# EAGLE design energia (EAGLE 6.1)

## Sheet 1 of 4: Base
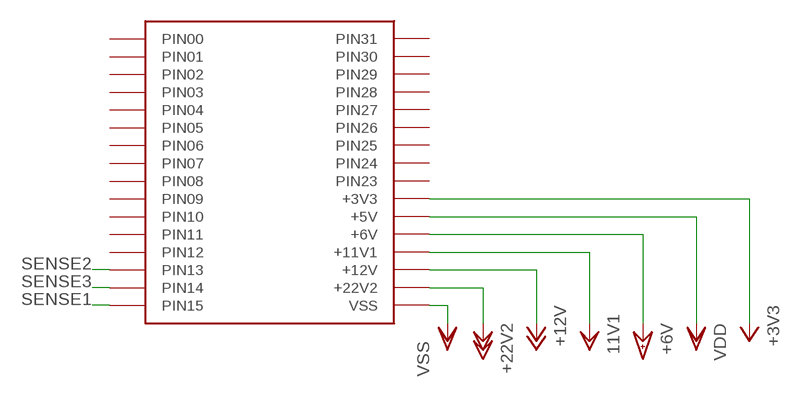
[diagram p0: schematic, sheet 1]

### Parts
U$1  BASE  [BASE]

### Nets
+3V3: U$1.PIN22(+3V3) ; also sheet 3
+6V: U$1.PIN20(+6V) ; also sheet 2
+11V1: U$1.PIN19(+11V1) ; supply symbol labelled 11V1 ; also sheet 3
+12V: U$1.PIN18(+12V) ; also sheet 2
+22V: U$1.PIN17(+22V2) ; supply symbol labelled +22V2 ; also sheet 2
SENSE1: U$1.PIN15 ; also sheet 4
SENSE2: U$1.PIN13 ; also sheet 4
SENSE3: U$1.PIN14 ; also sheet 4
VDD: U$1.PIN21(+5V) ; also sheet 3,4
VSS: U$1.PIN16(VSS) ; also sheet 2,3,4
Unconnected: U$1.PIN00 U$1.PIN01 U$1.PIN02 U$1.PIN03 U$1.PIN04 U$1.PIN05 U$1.PIN06 U$1.PIN07 U$1.PIN08 U$1.PIN09 U$1.PIN10 U$1.PIN11 U$1.PIN12 U$1.PIN23 U$1.PIN24 U$1.PIN25 U$1.PIN26 U$1.PIN27 U$1.PIN28 U$1.PIN29 U$1.PIN30 U$1.PIN31

## Sheet 2 of 4: Actuadores
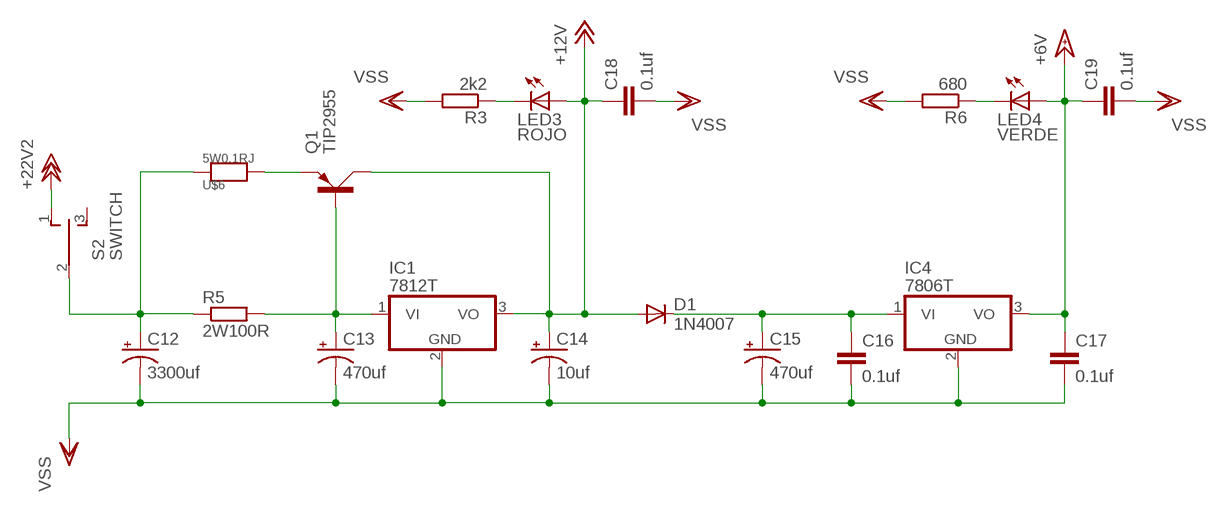
[diagram p1: schematic, sheet 2]

### Parts
C12  3300uf  CPOL-USE7.5-18  [E7,5-18]
C13  470uf  CPOL-USE3.5-8  [E3,5-8]
C14  10uf  CPOL-USE2.5-5  [E2,5-5]
C15  470uf  CPOL-USE3.5-8  [E3,5-8]
C16  0.1uf  C-EU050-024X044  [C050-024X044]
C17  0.1uf  C-EU050-024X044  [C050-024X044]
C18  0.1uf  C-EU050-024X044  [C050-024X044]
C19  0.1uf  C-EU050-024X044  [C050-024X044]
D1  1N4007  1N4004  [DO41-10]
IC1  7812T  [TO220H]
IC4  7806T  [TO220H]
LED3  ROJO  LED3MM  [LED3MM]
LED4  VERDE  LED3MM  [LED3MM]
Q1  TIP2955  [TOP3AV]
R3  2k2  R-EU_0204/5  [0204/5]
R5  2W100R  R-EU_0411/12  [0411/12]
R6  680  R-EU_0204/5  [0204/5]
S2  SWITCH  TL39YOSWITCH_2_ESTADOS  [TL3XYO]
U$6  5W0.1RJ  RESISTENCIA5WATT  [RES-22X10]

### Nets
+6V: C17.1 C19.1 IC4.3(VO) LED4.A ; also sheet 1
+12V: C14.+ C18.1 D1.A IC1.3(VO) LED3.A Q1.C ; also sheet 1
+22V: S2.1(O) ; supply symbol labelled +22V2 ; also sheet 1
N$3: LED3.K(C) R3.1
N$4: C12.+ R5.1 S2.2(P) U$6.P$1
N$7: Q1.E U$6.P$2
N$8: C13.+ IC1.1(VI) Q1.B R5.2
N$9: LED4.K(C) R6.1
N$13: C15.+ C16.1 D1.C IC4.1(VI)
VSS: C12.- C13.- C14.- C15.- C16.2 C17.2 C18.2 C19.2 IC1.2(GND) IC4.2(GND) R3.2 R6.2 ; also sheet 1,3,4
Unconnected: S2.3(S)

## Sheet 3 of 4: Energia Nucleo
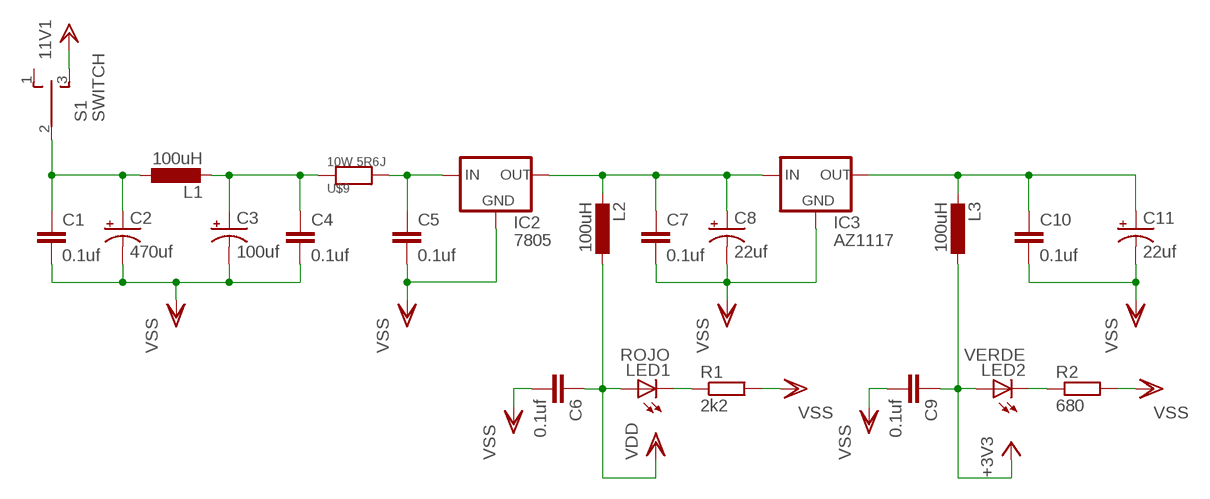
[diagram p2: schematic, sheet 3]

### Parts
C1  0.1uf  C-EU050-024X044  [C050-024X044]
C2  470uf  CPOL-USE2.5-7  [E2,5-7]
C3  100uf  CPOL-USE2.5-7  [E2,5-7]
C4  0.1uf  C-EU050-024X044  [C050-024X044]
C5  0.1uf  C-EU050-024X044  [C050-024X044]
C6  0.1uf  C-EU050-024X044  [C050-024X044]
C7  0.1uf  C-EU050-024X044  [C050-024X044]
C8  22uf  CPOL-USE2.5-7  [E2,5-7]
C9  0.1uf  C-EU050-024X044  [C050-024X044]
C10  0.1uf  C-EU050-024X044  [C050-024X044]
C11  22uf  CPOL-USE2.5-7  [E2,5-7]
IC2  7805  V_REG_78XX-TO-220  [TO-220-ALT]
IC3  AZ1117  V_REG_LD1117VXX  [78XXL]
L1  100uH  L-EUTFI0307  [TFI0307]
L2  100uH  L-EU0207/7  [0207/7]
L3  100uH  L-EU0207/7  [0207/7]
LED1  ROJO  LED3MM  [LED3MM]
LED2  VERDE  LED3MM  [LED3MM]
R1  2k2  R-EU_0204/5  [0204/5]
R2  680  R-EU_0204/5  [0204/5]
S1  SWITCH  TL39YOSWITCH_2_ESTADOS  [TL3XYO]
U$9  10W 5R6J  RESISTENCIA10W  [RES-49X10]

### Nets
+3V3: C9.1 L3.1 LED2.A ; also sheet 1
+11V1: S1.3(S) ; supply symbol labelled 11V1 ; also sheet 1
N$1: C1.1 C2.+ L1.1 S1.2(P)
N$10: C5.1 IC2.IN U$9.P$2
N$11: C3.+ C4.1 L1.2 U$9.P$1
N$12: C7.1 C8.+ IC2.OUT IC3.OUT(IN) L2.2
N$14: LED1.K(C) R1.1
N$17: C10.1 C11.+ IC3.GND(OUT) L3.2
N$18: LED2.K(C) R2.1
VDD: C6.1 L2.1 LED1.A ; also sheet 1,4
VSS: C1.2 C2.- C3.- C4.2 C5.2 C6.2 C7.2 C8.- C9.2 C10.2 C11.- IC2.GND IC3.IN(GND) R1.2 R2.2 ; also sheet 1,2,4
Unconnected: S1.1(O)

## Sheet 4 of 4: Monitor Lipo
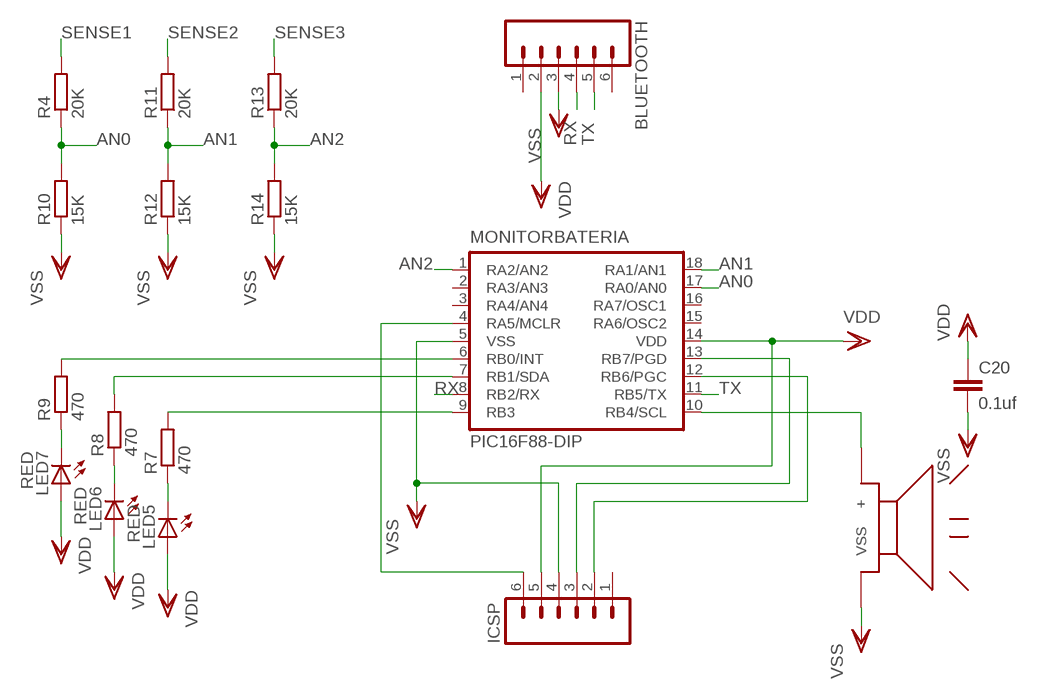
[diagram p3: schematic, sheet 4]

### Parts
BLUETOOTH  M06LONGPADS  [1X06_LONGPADS]
C20  0.1uf  C-EU050-024X044  [C050-024X044]
ICSP  M06LONGPADS  [1X06_LONGPADS]
LED5  RED  LED3MM  [LED3MM]
LED6  RED  LED3MM  [LED3MM]
LED7  RED  LED3MM  [LED3MM]
MONITORBATERIA  PIC16F88-DIP  [DIL18]
R4  20K  R-EU_0204/5  [0204/5]
R7  470  R-EU_0204/5  [0204/5]
R8  470  R-EU_0204/5  [0204/5]
R9  470  R-EU_0204/5  [0204/5]
R10  15K  R-EU_0204/5  [0204/5]
R11  20K  R-EU_0204/5  [0204/5]
R12  15K  R-EU_0204/5  [0204/5]
R13  20K  R-EU_0204/5  [0204/5]
R14  15K  R-EU_0204/5  [0204/5]
U$10  BUZZER  [BUZZER]

### Nets
AN0: MONITORBATERIA.17(RA0/AN0) R4.1 R10.2
AN1: MONITORBATERIA.18(RA1/AN1) R11.1 R12.2
AN2: MONITORBATERIA.1(RA2/AN2) R13.1 R14.2
N$2: ICSP.6 MONITORBATERIA.4(RA5/MCLR)
N$5: ICSP.3 MONITORBATERIA.13(RB7/PGD)
N$6: ICSP.2 MONITORBATERIA.12(RB6/PGC)
N$15: LED5.K(C) R7.1
N$16: LED7.K(C) R9.1
N$19: LED6.K(C) R8.1
N$20: MONITORBATERIA.6(RB0/INT) R9.2
N$21: MONITORBATERIA.7(RB1/SDA) R8.2
N$22: MONITORBATERIA.9(RB3) R7.2
N$24: MONITORBATERIA.10(RB4/SCL) U$10.+
RX: BLUETOOTH.4 MONITORBATERIA.8(RB2/RX)
SENSE1: R4.2 ; also sheet 1
SENSE2: R11.2 ; also sheet 1
SENSE3: R13.2 ; also sheet 1
TX: BLUETOOTH.5 MONITORBATERIA.11(RB5/TX)
VDD: BLUETOOTH.2 C20.1 ICSP.5 LED5.A LED6.A LED7.A MONITORBATERIA.14(VDD) ; also sheet 1,3
VSS: BLUETOOTH.3 C20.2 ICSP.4 MONITORBATERIA.5(VSS) R10.1 R12.1 R14.1 U$10.-(VSS) ; also sheet 1,2,3
Unconnected: BLUETOOTH.1 BLUETOOTH.6 ICSP.1 MONITORBATERIA.2(RA3/AN3) MONITORBATERIA.3(RA4/AN4) MONITORBATERIA.15(RA6/OSC2) MONITORBATERIA.16(RA7/OSC1)

## Library data of the parts
BLUETOOTH ICSP = SparkFun:M06: Header 6 Standard 6-pin 0.1" header. Use with straight break away headers (SKU : PRT-00116), right angle break away headers (PRT-00553), swiss pins (PRT-00743), machine pins (PRT-00117), and female headers (PRT-00115). Molex polarized connector foot print use with SKU : PRT-08094 with associated crimp pins and housings. NOTES ON THE VARIANTS LOCK and LOCK_LONGPADS... This footprint was designed to help hold the alignment of a through-hole component (i.e. 6-pin header) while soldering it into place. You may notice that each hole has been shifted either up or down by 0.005 of an inch from it's more standard position (which is a perfectly straight line). This slight alteration caused the pins (the squares in the middle) to touch the edges of the holes. Because they are alternating, it causes a "brace" to hold the component in place. 0.005 has proven to be the perfect amount of "off-center" position when using our standard breakaway headers. Although looks a little odd when you look at the bare footprint, once you have a header in there, the alteration is very hard to notice. Also, if you push a header all the way into place, it is covered up entirely on the bottom side. This idea of altering the position of holes to aid alignment will be further integrated into the Sparkfun Library for other footprints. It can help hold any component with 3 or more connection pins.
C1 C4-C7 C9 C10 C16-C20 = rcl:C-EU: CAPACITOR, European symbol
C2 C3 C8 C11-C15 = rcl:CPOL-US: POLARIZED CAPACITOR, American symbol
D1 = diode:1N4004: DIODE general purpose rectifier, 1 A
IC1 IC4 = adafruit:78*: Positive VOLTAGE REGULATOR Added bigger pads to the TO-92 package
IC2 = SparkFun:V_REG_78XX: Voltage Regulator Standard 7805 5V regulator. IGO (Input Ground Output). Spark Fun Electronics SKU : COM-00107
IC3 = SparkFun:V_REG_LD1117VXX: LD1117VXX voltage regulator. We carry the 3.3V version (COM-00526) in TO-220 package.
L1-L3 = rcl:L-EU: INDUCTOR, European symbol
LED1-LED7 = adafruit:LED: LED OSRAM: - CHIPLED LG R971, LG N971, LY N971, LG Q971, LY Q971, LO R971, LY R971 LH N974, LH R974 LS Q976, LO Q976, LY Q976 LO Q996 - Hyper CHIPLED LW Q18S LB Q993, LB Q99A, LB R99A - SideLED LS A670, LO A670, LY A670, LG A670, LP A670 LB A673, LV A673, LT A673, LW A673 LH A674 LY A675 LS A676, LA A676, LO A676, LY A676, LW A676 LS A679, LY A679, LG A679 - Hyper Micro SIDELED® LS Y876, LA Y876, LO Y876, LY Y876 LT Y87S - SmartLED LW L88C, LW L88S LB L89C, LB L89S, LG L890 LS L89K, LO L89K, LY L89K LS L896, LA L896, LO L896, LY L896 - TOPLED LS T670, LO T670, LY T670, LG T670, LP T670 LSG T670, LSP T670, LSY T670, LOP T670, LYG T670 LG T671, LOG T671, LSG T671 LB T673, LV T673, LT T673, LW T673 LH T674 LS T676, LA T676, LO T676, LY T676, LB T676, LH T676, LSB T676, LW T676 LB T67C, LV T67C, LT T67C, LS T67K, LO T67K, LY T67K, LW E67C LS E67B, LA E67B, LO E67B, LY E67B, LB E67C, LV E67C, LT E67C LW T67C LS T679, LY T679, LG T679 LS T770, LO T770, LY T770, LG T770, LP T770 LB T773, LV T773, LT T773, LW T773 LH T774 LS E675, LA E675, LY E675, LS T675 LS T776, LA T776, LO T776, LY T776, LB T776 LHGB T686 LT T68C, LB T68C - Hyper Mini TOPLED® LB M676 - Mini TOPLED Santana® LG M470 LS M47K, LO M47K, LY M47K Source: http://www.osram.convergy.de/
MONITORBATERIA = SparkFun:PIC16F88-DIP
Q1 = transistor-power:TIP2955: PNP TRANSISTOR
R1-R14 = rcl:R-EU_: RESISTOR, European symbol
S1 S2 = aasanchez:TL39YO: TINY SWITCH ON OFF ON Source: http://www2.produktinfo.conrad.com/datenblaetter/700000-724999/705152-da-01-de-Subminiaturschalter_TL_36YO.pdf
U$1 = aasanchez:BASE
U$6 U$9 = aasanchez:RESISTENCIA
U$10 = aasanchez:BUZZER

## Board
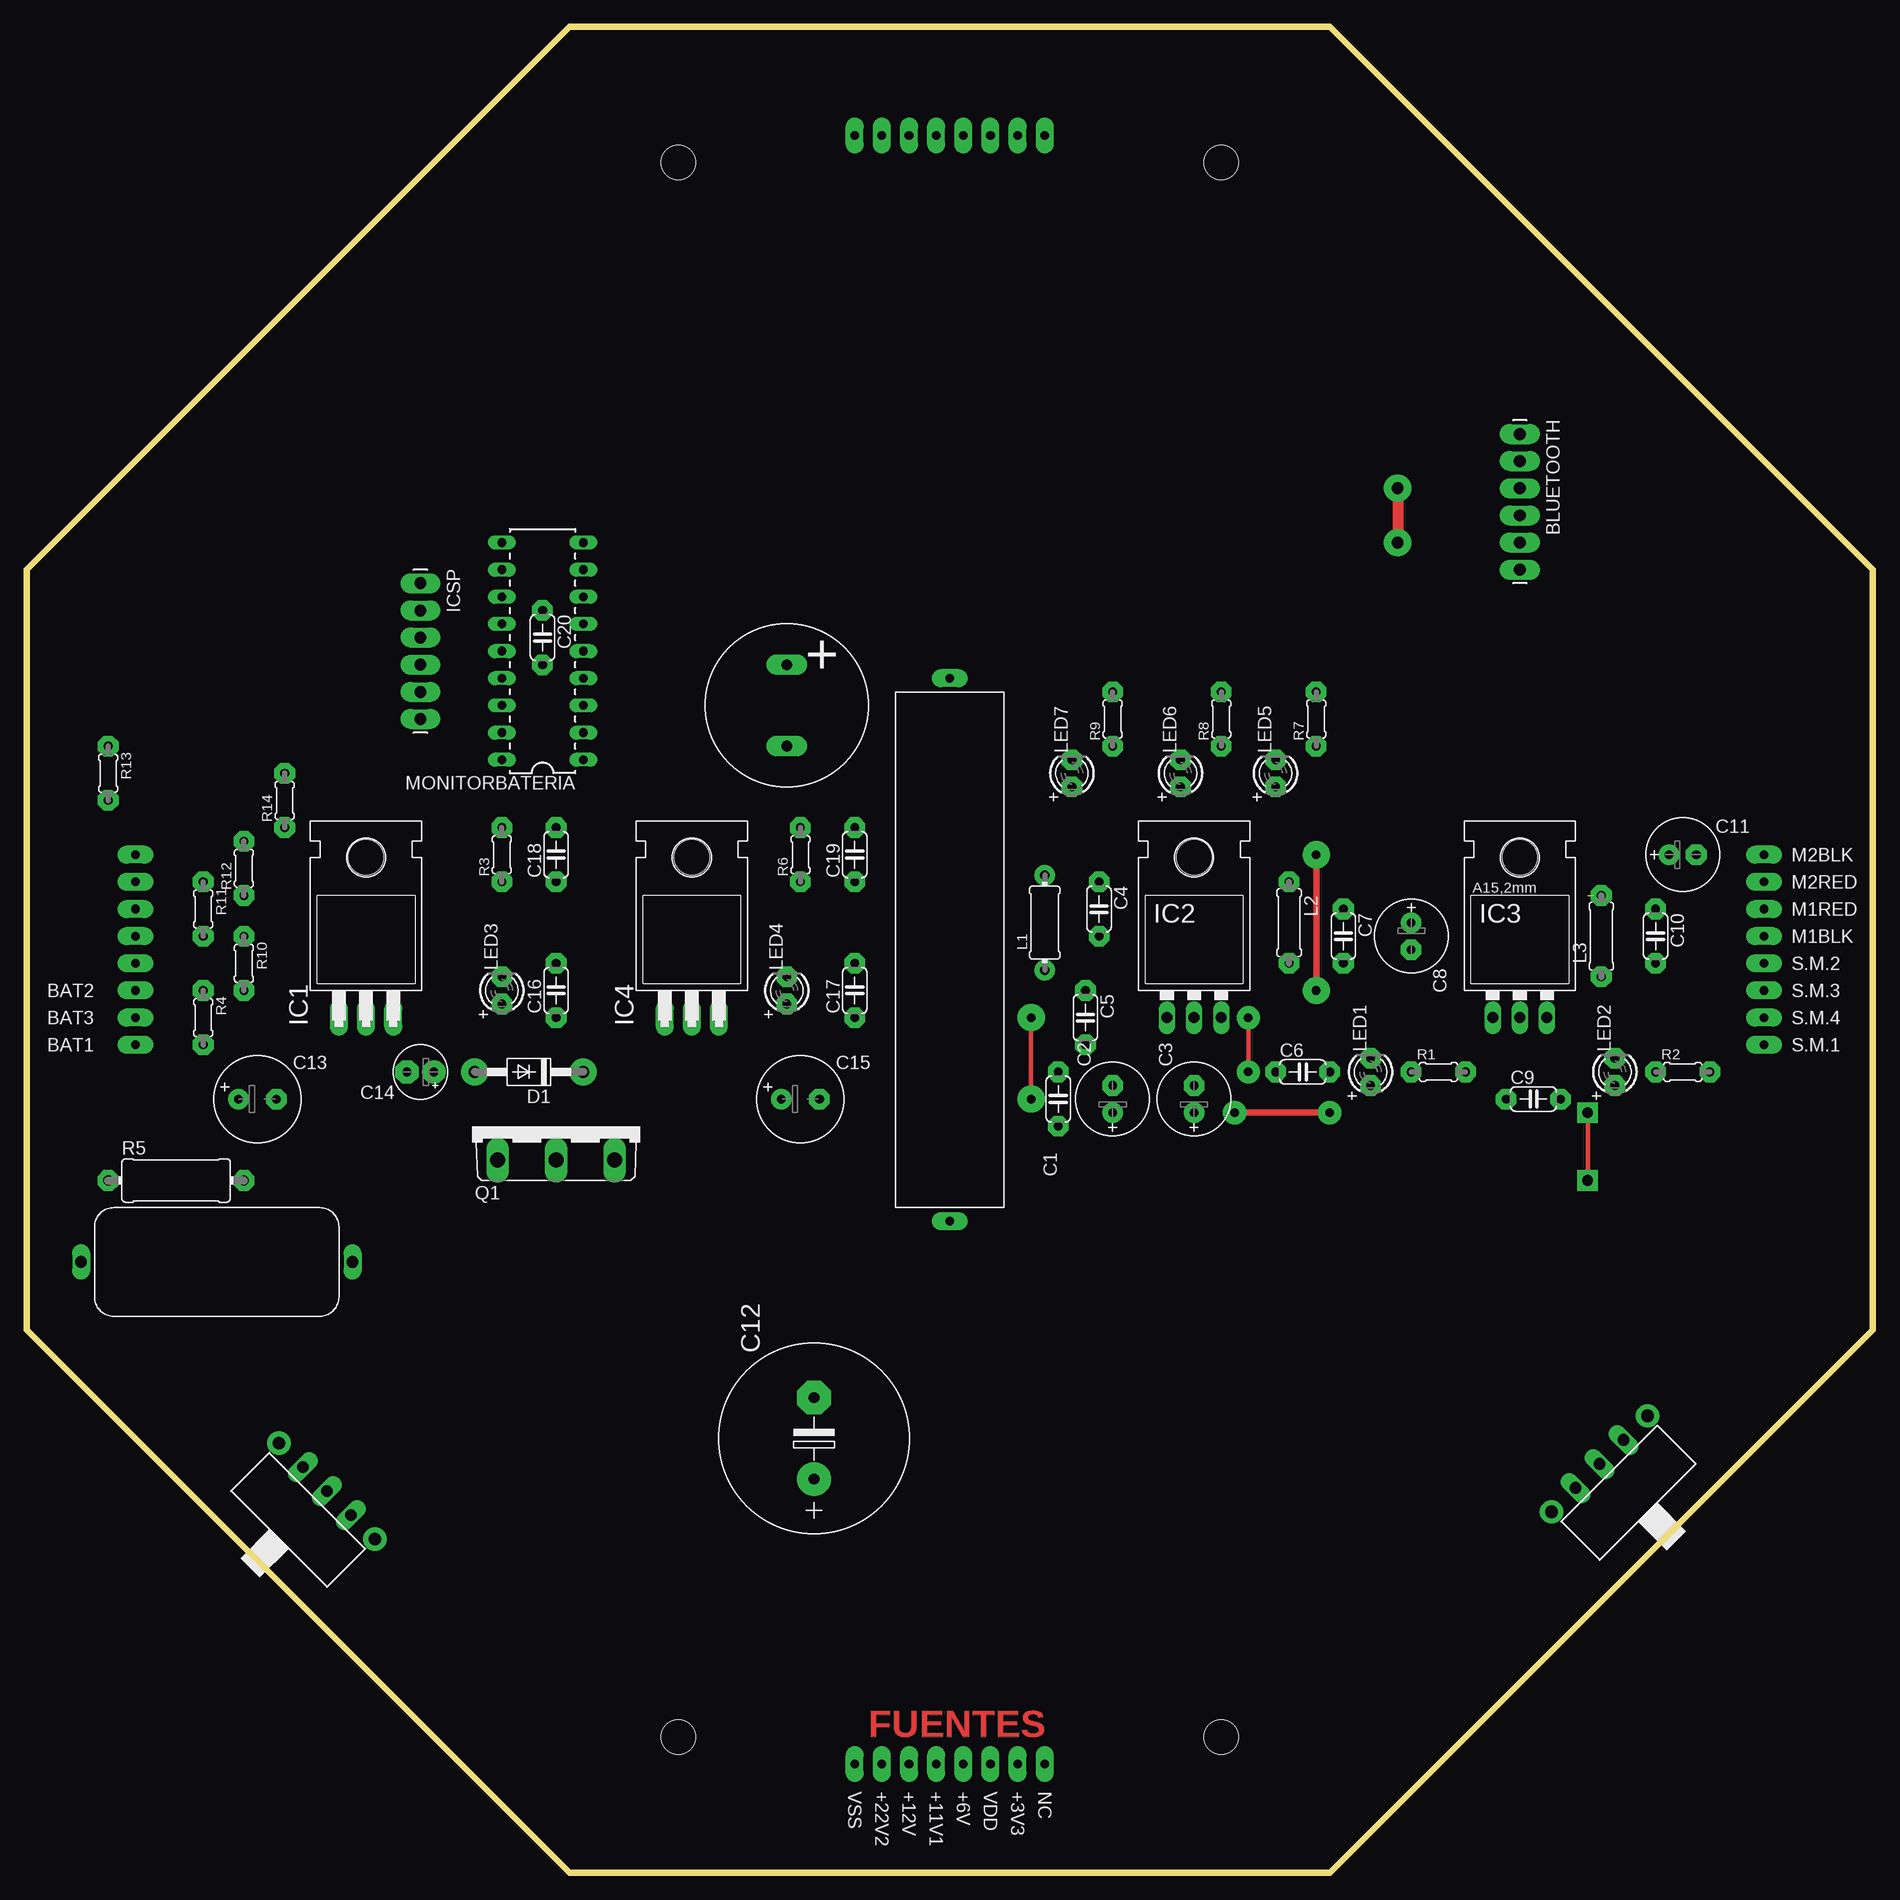
[diagram p4: board, top side]
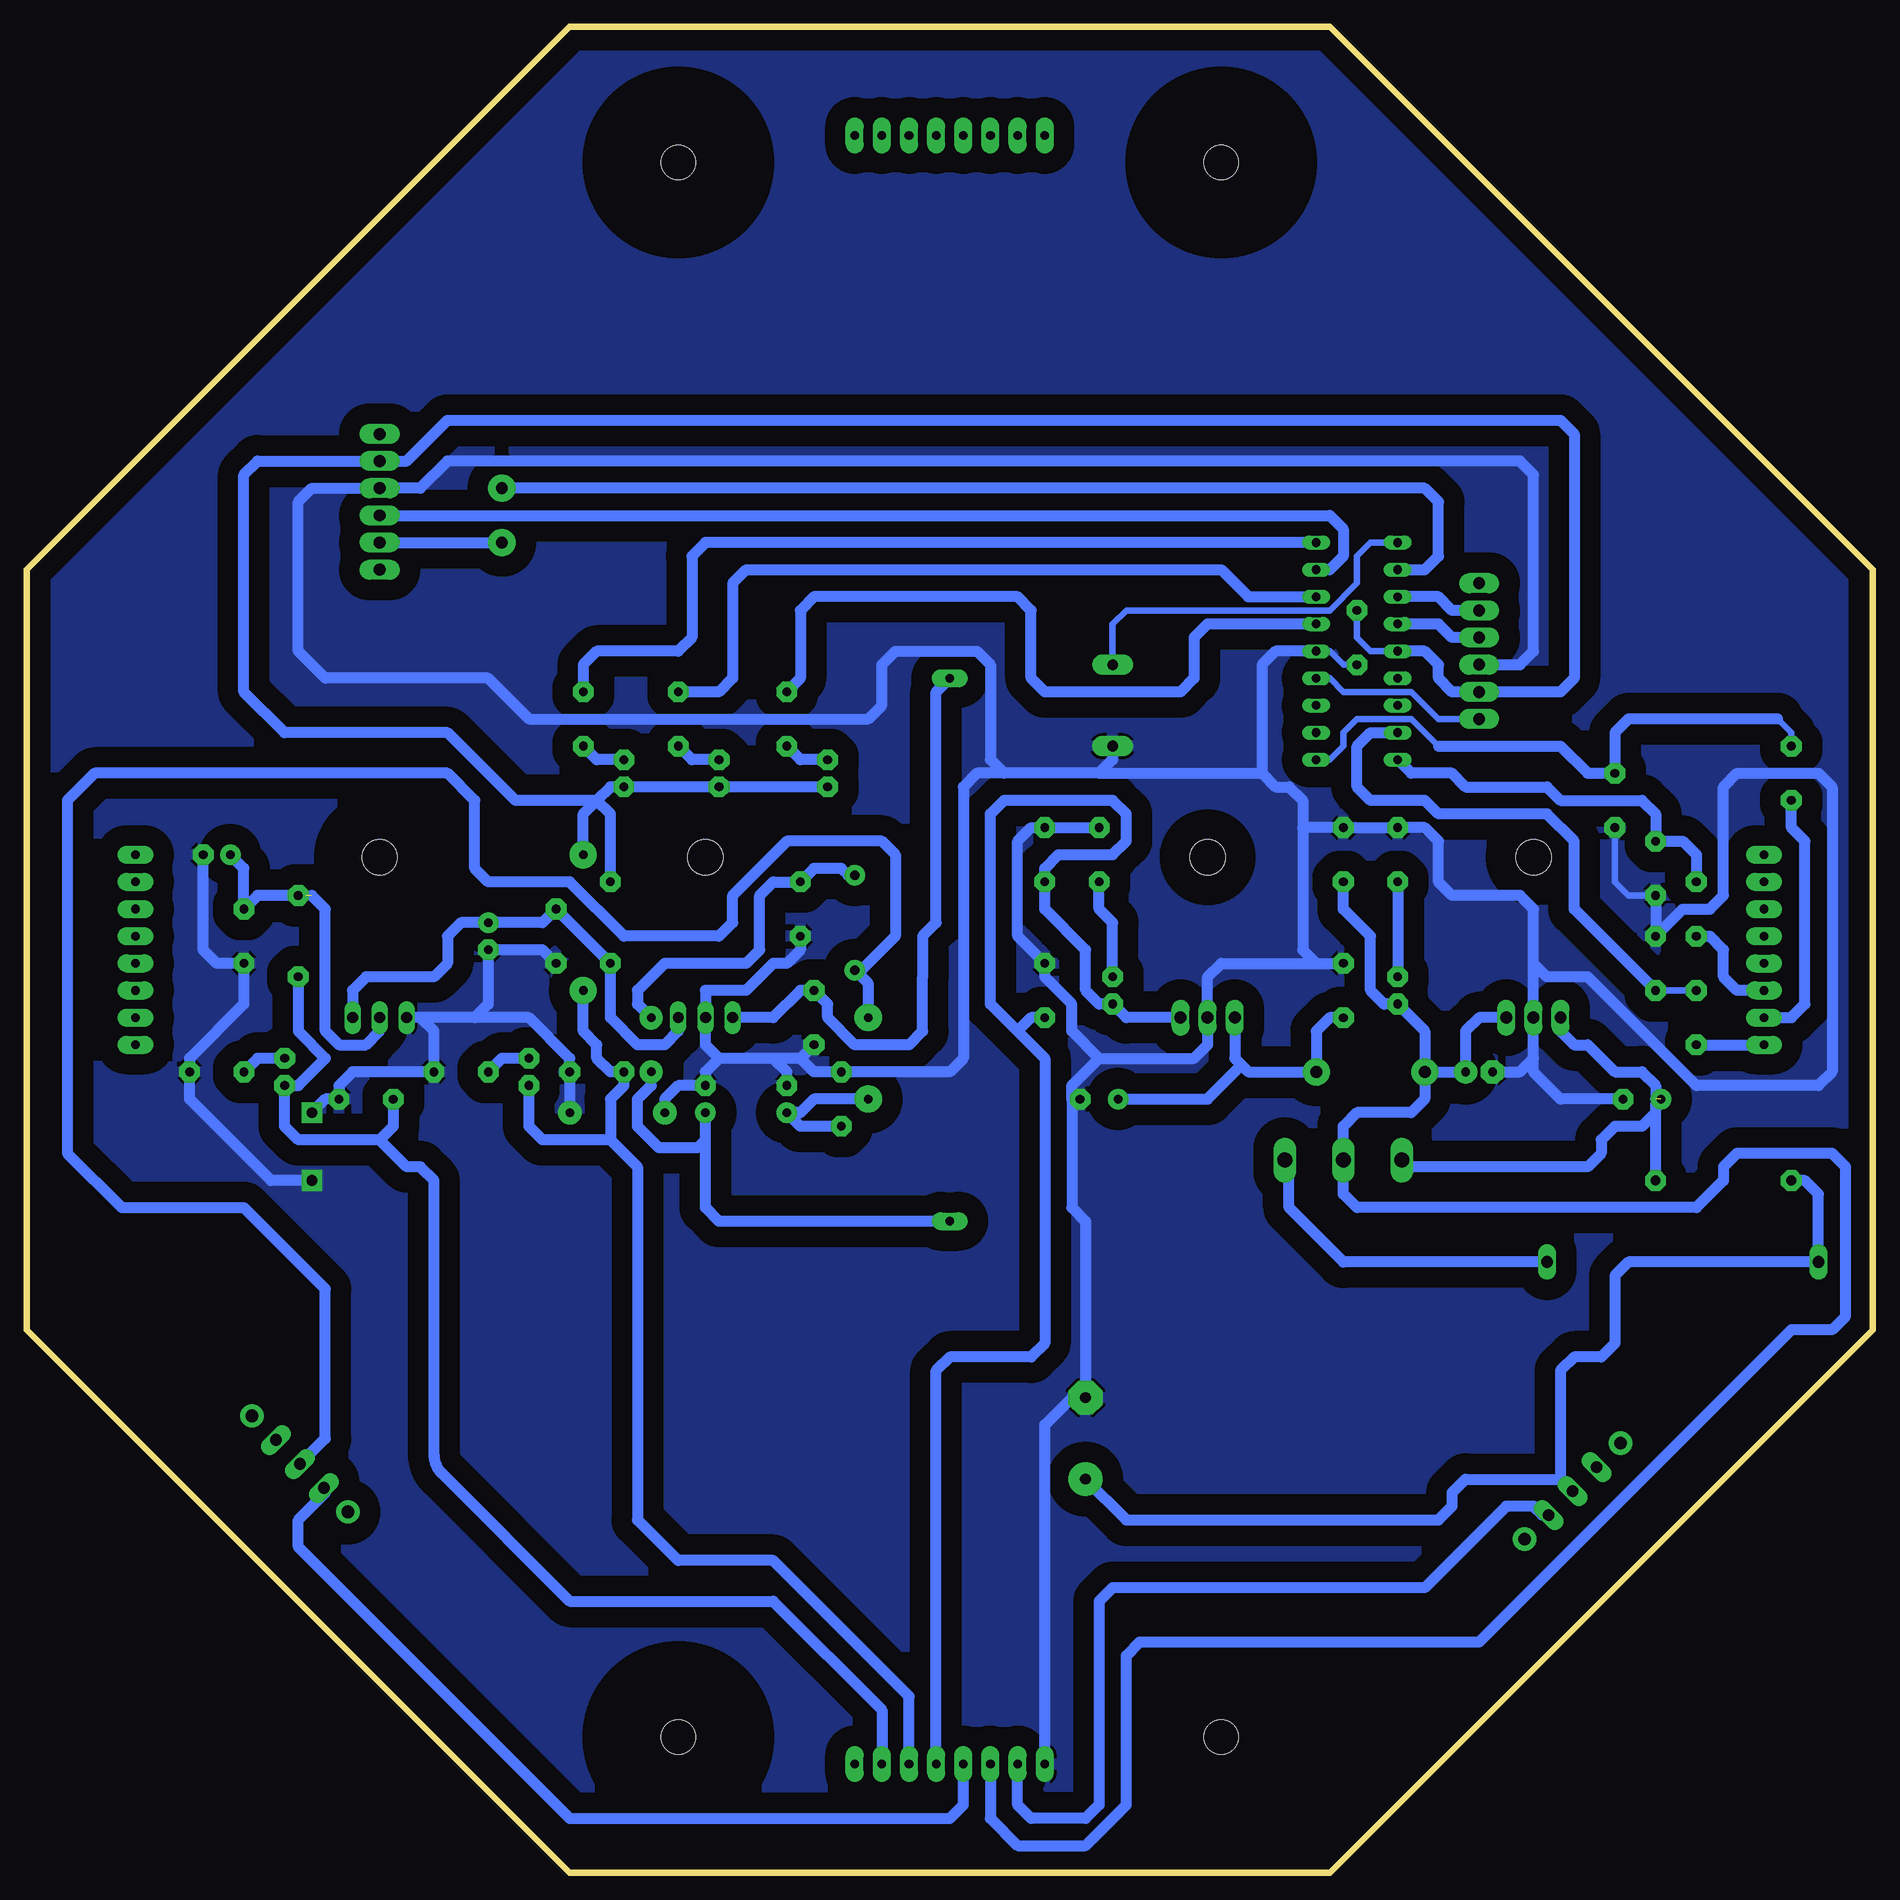
[diagram p5: board, bottom side, seen from below]

Size 172.72 x 172.72 mm. Coordinates in mm from the lower left corner, seen from the top.
Copper layers (1*16): Top 0.035mm / dielectric 1.5mm / Bottom 0.035mm
Design rules: minimum track width 10mil, minimum drill 24mil, track to track 8mil, track to pad 8mil, pad to pad 8mil, via to via 8mil, smd to smd 8mil, copper to edge 40mil, drill to drill 8mil, minimum pad ring 10mil, minimum via ring 8mil, stop-mask expansion 4mil, vias tented up to drill 0mil, thermal gap 10mil

### Footprints (pad centres in the part's own frame; a part is rotated, then mirrored left to right if it is on the bottom)
1X06_LONGPADS = drill 1.118 pad 1.88 long: 1 0,0; 2 2.54,0; 3 5.08,0; 4 7.62,0; 5 10.16,0; 6 12.7,0
C050-024X044 = drill 0.813 pad 1.93 octagon: 1 -2.54,0; 2 2.54,0
E2,5-7 = drill 0.813 pad 1.93: + -1.27,0 | drill 0.813 pad 1.93 octagon: - 1.27,0
E7,5-18 = drill 1.016 pad 3.15: + -3.81,0 | drill 1.016 pad 3.15 octagon: - 3.81,0
E3,5-8 = drill 0.813 pad 1.93: + -1.778,0 | drill 0.813 pad 1.93 octagon: - 1.778,0
E2,5-5 = drill 0.813 pad 2.184: + -1.27,0 | drill 0.813 pad 2.184 octagon: - 1.27,0
DO41-10 = drill 1.118 pad 2.54: A 5.08,0; C -5.08,0
TO220H = drill 1.118 long: 1 -2.54,-10.16; 2 0,-10.16; 3 2.54,-10.16 | hole 3.302: 0,4.826
TO-220-ALT = drill 1.016 long: GND 0,-3.81; IN -2.54,-3.81; OUT 2.54,-3.81 | hole 3.302: 0,11.176
78XXL = drill 1.016 long: GND 0,-3.81; IN -2.54,-3.81; OUT 2.54,-3.81 | hole 3.302: 0,11.176
TFI0307 = drill 0.9 pad 1.93: 1 -4.445,0; 2 4.445,0
0207/7 = drill 0.813 pad 1.93 octagon: 1 -3.81,0; 2 3.81,0
LED3MM = drill 0.813 pad 1.93 octagon: A -1.27,0; K 1.27,0
DIL18 = drill 0.813 long: 1 -10.16,-3.81; 2 -7.62,-3.81; 3 -5.08,-3.81; 4 -2.54,-3.81; 5 0,-3.81; 6 2.54,-3.81; 7 5.08,-3.81; 8 7.62,-3.81; 9 10.16,-3.81; 10 10.16,3.81; 11 7.62,3.81; 12 5.08,3.81; 13 2.54,3.81; 14 0,3.81; 15 -2.54,3.81; 16 -5.08,3.81; 17 -7.62,3.81; 18 -10.16,3.81
TOP3AV = drill 1.397 long: B -5.461,-3.175; C 0,-3.175; E 5.461,-3.175
0204/5 = drill 0.813 pad 1.93 octagon: 1 -2.54,0; 2 2.54,0
0411/12 = drill 0.914 pad 1.93 octagon: 1 -6.35,0; 2 6.35,0
TL3XYO = drill 1.1 pad 1.422 long: 1 -3.175,-3.81; 2 0,-3.81; 3 3.175,-3.81 | drill 1.2 pad 2.184: M1 -6.35,-3.81; M2 6.35,-3.81
BASE = drill 0.8 pad 1.676 long: PIN00 8.89,76.2; PIN01 6.35,76.2; PIN02 3.81,76.2; PIN03 1.27,76.2; PIN04 -1.27,76.2; PIN05 -3.81,76.2; PIN06 -6.35,76.2; PIN07 -8.89,76.2; PIN08 -76.2,8.89; PIN09 -76.2,6.35; PIN10 -76.2,3.81; PIN11 -76.2,1.27; PIN12 -76.2,-1.27; PIN13 -76.2,-3.81; PIN14 -76.2,-6.35; PIN15 -76.2,-8.89; PIN16 -8.89,-76.2; PIN17 -6.35,-76.2; PIN18 -3.81,-76.2; PIN19 -1.27,-76.2; PIN20 1.27,-76.2; PIN21 3.81,-76.2; PIN22 6.35,-76.2; PIN23 8.89,-76.2; PIN24 76.2,-8.89; PIN25 76.2,-6.35; PIN26 76.2,-3.81; PIN27 76.2,-1.27; PIN28 76.2,1.27; PIN29 76.2,3.81; PIN30 76.2,6.35; PIN31 76.2,8.89 | hole 3.2: -25.4,73.66; 25.4,73.66; -25.4,-73.66; 25.4,-73.66
RES-22X10 = drill 1.1 pad 1.676 long: P$1 -12.7,0; P$2 12.7,0
RES-49X10 = drill 0.8 pad 1.676 long: P$1 -25.4,0; P$2 25.4,0
BUZZER = drill 1 pad 1.93 long: + -3.81,0; - 3.81,0

### Placement (x,y rotation side)
BLUETOOTH  139.7,134.62 270 top
C1  96.52,72.39 90 top
C2  101.6,72.39 90 top
C3  109.22,72.39 90 top
C4  100.33,90.17 270 top
C5  99.06,80.01 270 top
C6  119.38,74.93 0 top
C7  123.19,87.63 270 top
C8  129.54,87.63 270 top
C9  140.97,72.39 0 top
C10  152.4,87.63 270 top
C11  154.94,95.25 0 top
C12  73.66,40.64 90 top
C13  21.59,72.39 0 top
C14  36.83,74.93 180 top
C15  72.39,72.39 0 top
C16  49.53,82.55 90 top
C17  77.47,82.55 90 top
C18  49.53,95.25 90 top
C19  77.47,95.25 90 top
C20  48.26,115.57 270 top
D1  46.99,74.93 180 top
IC1  31.75,90.17 0 top
IC2  109.22,83.82 0 top
IC3  139.7,83.82 0 top
IC4  62.23,90.17 0 top
ICSP  36.83,120.65 270 top
L1  95.25,88.9 90 top
L2  118.11,88.9 270 top
L3  147.32,87.63 90 top
LED1  125.73,74.93 90 top
LED2  148.59,74.93 90 top
LED3  44.45,82.55 90 top
LED4  71.12,82.55 90 top
LED5  116.84,102.87 90 top
LED6  107.95,102.87 90 top
LED7  97.79,102.87 90 top
MONITORBATERIA  48.26,114.3 90 top
Q1  49.53,69.85 0 top
R1  132.08,74.93 0 top
R2  154.94,74.93 0 top
R3  44.45,95.25 90 top
R4  16.51,80.01 270 top
R5  13.97,64.77 0 top
R6  72.39,95.25 90 top
R7  120.65,107.95 90 top
R8  111.76,107.95 90 top
R9  101.6,107.95 90 top
R10  20.32,85.09 270 top
R11  16.51,90.17 270 top
R12  20.32,93.98 90 top
R13  7.62,102.87 270 top
R14  24.13,100.33 90 top
S1  149.86,35.56 225 top
S2  25.4,33.02 135 top
U$1  86.36,86.36 0 top
U$6  17.78,57.15 0 top
U$9  86.36,86.36 90 top
U$10  71.12,109.22 270 top

### Tracks (layer width: path | path; a pad name or v marks a point on that pad's centre or on a via)
+3V3
  Bottom 1.016: L3.1 147.32,78.74 144.78,76.2 147.32,73.66 LED2.A 148.59,69.85 147.32,68.58 139.7,68.58 | U$1.PIN22 92.71,15.24 102.87,25.4 121.92,25.4 133.88,37.36 arc45 134.62,39.15 134.62,64.77 135.89,66.04 137.16,66.04 139.7,68.58 | C9.1 138.43,69.85 139.7,68.58
+6V
  Bottom 1.016: IC4.3 69.85,80.01 LED4.A 72.39,81.28 73.66,82.55 73.66,86.36 77.47,90.17 C19.1 77.47,93.98 76.2,95.25 71.12,95.25 69.85,96.52 69.85,99.06 71.12,100.33 81.28,100.33 82.55,99.06 82.55,81.28 80.01,78.74 | U$1.PIN20 87.63,46.99 86.36,48.26 78.74,48.26 77.47,49.53 77.47,76.2 80.01,78.74 | C17.1 78.74,80.01 80.01,78.74
+11V1
  Bottom 1.016: U$1.PIN19 85.09,6.35 86.36,5.08 121.92,5.08 147.32,30.48 147.32,33.02 144.78,35.56 144.92,35.7 S1.3
+12V
  Bottom 1.016: IC1.3 36.83,80.01 38.1,78.74 C14.+ D1.A | D1.A 41.91,72.39 43.18,71.12 48.26,71.12 49.53,69.85 Q1.C 49.53,63.5 48.26,62.23 16.51,62.23 13.97,64.77 13.97,66.04 12.7,67.31 3.81,67.31 2.54,66.04 2.54,52.07 3.81,50.8 7.62,50.8 36.83,21.59 68.58,21.59 69.85,20.32 69.85,6.35 73.66,2.54 80.01,2.54 82.55,5.08 U$1.PIN18 | D1.A 41.91,78.74 LED3.A 45.72,81.28 46.99,82.55 46.99,87.63 49.53,90.17 C18.1
+22V
  Bottom 1.016: S2.1 30.93,33.47 31.75,34.29 34.29,34.29 41.91,26.67 71.12,26.67 72.39,25.4 72.39,6.35 73.66,5.08 78.74,5.08 80.01,6.35 U$1.PIN17
AN0
  Bottom 0.61: R4.1 R10.2
  Bottom 1.016: R10.2 27.94,90.17 27.94,96.52 30.48,99.06 40.64,99.06 41.91,100.33 46.99,100.33 48.26,101.6 48.26,105.41 46.99,106.68 MONITORBATERIA.17
AN1
  Bottom 1.016: MONITORBATERIA.18 43.18,102.87 39.37,102.87 38.1,101.6 30.48,101.6 29.21,100.33 21.59,100.33 20.32,99.06 R12.2 17.78,96.52 16.51,95.25 R11.1
AN2
  Bottom 0.61: R13.1 7.62,106.68 8.89,107.95 | 40.64,105.41 43.18,107.95 48.26,107.95 49.53,106.68 49.53,105.41 50.8,104.14 MONITORBATERIA.1
  Bottom 1.016: 8.89,107.95 22.86,107.95 24.13,106.68 R14.2 26.67,102.87 29.21,105.41 40.64,105.41
N$1  (via drill 0.8 pad 2.54)
  Top 0.406: v93.98,72.39 v93.98,80.01
  Bottom 0.61: S1.2
  Bottom 1.016: v93.98,80.01 93.98,83.19 L1.1 94.61,84.45 91.44,87.63 91.44,95.25 92.71,96.52 101.6,96.52 106.68,91.44 106.68,88.9 107.95,87.63 116.84,87.63 121.92,92.71 129.54,92.71 130.81,93.98 130.81,100.33 133.35,102.87 166.37,102.87 168.91,100.33 168.91,67.31 163.83,62.23 152.4,62.23 144.78,54.61 144.78,40.64 S1.2 | v93.98,72.39 99.06,72.39 100.33,71.12 C2.+ 100.33,69.85 C1.1
N$2
  Bottom 0.61: MONITORBATERIA.4 50.8,111.76 49.53,110.49 43.18,110.49 40.64,107.95 ICSP.6
N$3
  Bottom 1.016: R3.1 LED3.K
N$4
  Bottom 1.016: C12.+ 69.85,33.02 40.64,33.02 39.37,34.29 39.37,35.56 38.1,36.83 29.21,36.83 | 29.21,36.83 S2.2 29.21,36.83 | R5.1 6.35,64.77 5.08,63.5 U$6.P$1 22.86,57.15 24.13,55.88 24.13,49.53 25.4,48.26 27.94,48.26 29.21,46.99 29.21,36.83
N$5
  Bottom 1.016: MONITORBATERIA.13 40.64,116.84 39.37,115.57 ICSP.3
N$6
  Bottom 1.016: MONITORBATERIA.12 40.64,119.38 39.37,118.11 ICSP.2
N$7
  Bottom 1.016: U$6.P$2 49.53,57.15 54.61,62.23 54.61,66.04 54.99,66.42 Q1.E
N$8  (1 unrouted)
  Bottom 1.016: R5.2 20.32,71.12 | 20.32,71.12 20.32,71.88 C13.+ | 20.32,71.12 21.59,69.85 24.13,69.85 25.4,68.58 25.4,67.31 26.67,66.04 43.43,66.04 Q1.B | IC1.1 29.21,78.74 27.94,77.47 26.67,77.47 24.13,74.93 21.59,74.93 20.32,73.66 20.32,72.39
N$9
  Bottom 1.016: LED4.K 71.12,88.9 72.39,90.17 R6.1
N$10
  Bottom 1.016: U$9.P$2 87.63,110.49 87.63,88.9 88.9,87.63 88.9,85.09 88.9,83.82 88.9,78.74 90.17,77.47 95.25,77.47 97.79,80.01 97.79,81.28 C5.1 100.33,82.55 102.87,80.01 IC2.IN
N$11  (via drill 0.8 pad 2.18)
  Top 0.406: v114.3,80.01 v114.3,74.93
  Bottom 1.016: U$9.P$1 107.95,60.96 109.22,62.23 109.22,68.58 | 109.22,68.58 C3.+ | L1.2 95.88,93.34 96.52,93.98 99.06,93.98 C4.1 102.87,92.71 104.14,91.44 104.14,86.36 105.41,85.09 113.03,85.09 115.57,82.55 115.57,81.28 v114.3,80.01 | 109.22,68.58 109.96,67.84 113.56,67.84 115.57,69.85 115.57,72.39 114.3,73.66 v114.3,74.93 114.3,74.71
N$12
  Bottom 1.016: IC3.OUT 142.24,82.55 140.97,83.82 134.62,83.82 133.35,85.09 133.35,87.63 132.08,88.9 C8.+ 124.46,88.9 C7.1 L2.2 118.11,80.01 115.57,77.47 113.03,77.47 111.76,78.74 IC2.OUT
N$13
  Bottom 1.016: C16.1 50.8,80.01 52.07,78.74 D1.C 58.42,74.93 59.05,75.56 | IC4.1 59.69,76.2 59.05,75.56 | C15.+ 62.23,72.39 59.05,75.56
N$14
  Bottom 1.016: LED1.K 128.27,76.2 R1.1
N$15
  Bottom 1.016: LED5.K 119.38,104.14 R7.1
N$16
  Bottom 1.016: LED7.K 100.33,104.14 R9.1
N$17  (1 unrouted)
  Bottom 1.016: 146.58,91.44 L3.2 151.13,91.44 C10.1 152.4,93.98 C11.+ | IC3.GND 139.7,78.74 140.97,77.47 143.51,77.47 144.78,78.74 144.78,90.17 146.05,91.44
N$18
  Bottom 1.016: LED2.K 151.13,76.2 R2.1
N$19
  Bottom 1.016: LED6.K 110.49,104.14 R8.1
N$20
  Bottom 1.016: MONITORBATERIA.6 62.23,116.84 63.5,115.57 63.5,111.76 64.77,110.49 77.47,110.49 78.74,111.76 78.74,118.11 80.01,119.38 99.06,119.38 100.33,118.11 100.33,111.76 R9.2
N$21
  Bottom 1.016: MONITORBATERIA.7 58.42,119.38 60.96,121.92 105.41,121.92 106.68,120.65 106.68,111.76 107.95,110.49 R8.2
N$22
  Bottom 1.016: MONITORBATERIA.9 109.22,124.46 110.49,123.19 110.49,115.57 111.76,114.3 119.38,114.3 120.65,113.03 R7.2
N$24
  Bottom 0.61: MONITORBATERIA.10 46.99,124.46 48.26,123.19 48.26,120.65 50.8,118.11 69.85,118.11 71.12,116.84 U$10.+
RX
  Bottom 1.016: BLUETOOTH.4 50.8,127 49.53,125.73 49.53,123.19 50.8,121.92 MONITORBATERIA.8
SENSE1
  Bottom 1.016: R4.2 U$1.PIN15
SENSE2
  Bottom 1.016: U$1.PIN13 12.7,82.55 13.97,83.82 13.97,86.36 15.24,87.63 R11.2
SENSE3
  Bottom 1.016: U$1.PIN14 7.62,80.01 6.35,81.28 6.35,96.52 7.62,97.79 R13.2
TX  (via drill 1.1 pad 2.54)
  Top 1.016: v128.27,129.54 v128.27,124.46
  Bottom 1.016: v128.27,129.54 41.91,129.54 40.64,128.27 40.64,123.19 41.91,121.92 MONITORBATERIA.11 | BLUETOOTH.5 v128.27,124.46
VDD  (via drill 0.8 pad 2.54)
  Top 0.61: v120.65,82.55 v120.65,95.25
  Bottom 0.61: MONITORBATERIA.14 46.99,114.3 48.26,115.57 C20.1
  Bottom 1.016: L2.1 118.11,99.06 119.38,100.33 | U$1.PIN21 90.17,16.51 102.87,29.21 111.76,29.21 115.57,33.02 115.57,66.04 118.11,68.58 | MONITORBATERIA.14 41.91,114.3 40.64,113.03 40.64,111.76 39.37,110.49 ICSP.5 29.21,110.49 27.94,111.76 27.94,134.62 29.21,135.89 133.35,135.89 137.16,132.08 BLUETOOTH.2 151.13,132.08 152.4,130.81 152.4,110.49 148.59,106.68 133.35,106.68 127,100.33 119.38,100.33 | v120.65,82.55 120.65,78.74 119.38,77.47 119.38,76.2 118.11,74.93 C6.1 116.84,73.66 118.11,72.39 118.11,68.58 | 118.11,68.58 124.46,68.58 125.73,69.85 LED1.A | LED7.A LED6.A LED5.A 118.11,101.6 119.38,100.33 | v120.65,95.25 120.65,99.06 119.38,100.33
VSS  (via drill 0.8 pad 2.18, 1 pad 1.93)
  Top 0.406: v146.05,71.12 v146.05,64.77
  Top 0.61: v121.92,71.12 v113.03,71.12
  Bottom 0.61: MONITORBATERIA.5 50.8,114.3 49.53,113.03 C20.2 | R12.1 22.86,91.44 24.13,92.71 R14.1
  Bottom 1.016: U$1.PIN16 77.47,41.91 74.93,44.45 C12.- 73.66,60.96 74.93,62.23 74.93,72.39 | 72.39,76.2 63.5,76.2 62.23,77.47 IC4.2 62.23,83.82 60.96,85.09 52.07,85.09 | C13.- 29.21,72.39 31.75,74.93 31.75,76.2 | R6.2 C19.2 78.74,97.79 80.01,96.52 80.01,87.63 C17.2 77.47,83.82 74.93,81.28 74.93,78.74 72.39,76.2 | 53.34,97.79 C18.2 R3.2 41.91,97.79 40.64,96.52 40.64,92.71 39.37,91.44 33.02,91.44 31.75,90.17 31.75,85.09 | 53.34,97.79 53.34,86.36 52.07,85.09 | 52.07,85.09 C16.2 | C14.- 33.02,74.93 31.75,76.2 | 31.75,76.2 IC1.2 31.75,85.09 | 100.33,76.2 C5.2 | C4.2 100.33,86.36 101.6,85.09 102.87,85.09 105.41,82.55 109.22,82.55 IC2.GND 109.22,77.47 107.95,76.2 | 31.75,85.09 30.48,83.82 26.67,83.82 16.51,73.66 5.08,73.66 3.81,74.93 3.81,101.6 5.08,102.87 12.7,102.87 13.97,101.6 13.97,91.44 15.24,90.17 17.78,90.17 R10.1 R12.1 | v121.92,71.12 C6.2 121.92,76.2 125.73,80.01 130.81,80.01 | C11.- 156.21,86.36 154.94,85.09 C10.2 152.4,81.28 157.48,76.2 R2.2 157.48,72.39 149.86,64.77 v146.05,64.77 | 130.81,80.01 129.54,81.28 C8.- 124.46,86.36 C7.2 | 130.81,80.01 135.89,80.01 | 135.89,80.01 IC3.IN | 135.89,80.01 134.62,78.74 R1.2 142.24,74.93 143.51,73.66 C9.2 144.78,72.39 v146.05,71.12 | 100.33,76.2 102.87,76.2 | 102.87,76.2 107.95,76.2 | 107.95,76.2 109.22,74.93 C3.- 111.76,73.66 113.03,72.39 v113.03,71.12 | C2.- 101.6,74.93 102.87,76.2 | C15.- 74.93,72.39 | 72.39,76.2 74.93,73.66 74.93,72.39 | 100.33,76.2 99.06,74.93 C1.2 86.36,74.93 85.09,76.2 85.09,101.6 83.82,102.87 81.28,102.87 | ICSP.4 33.02,113.03 31.75,114.3 31.75,130.81 33.02,132.08 133.35,132.08 135.89,129.54 BLUETOOTH.3 146.05,129.54 147.32,128.27 147.32,114.3 144.78,111.76 129.54,111.76 125.73,107.95 93.98,107.95 92.71,109.22 92.71,113.03 91.44,114.3 83.82,114.3 82.55,113.03 82.55,104.14 81.28,102.87
  Bottom 1.016: MONITORBATERIA.5 55.88,114.3 57.15,113.03 57.15,102.87 | 57.15,102.87 55.88,101.6 54.61,101.6 53.34,100.33 53.34,97.79 | 72.39,102.87 57.15,102.87 | U$10.- 71.12,104.14 72.39,102.87 | 72.39,102.87 81.28,102.87
  pour Bottom (isolate 1.93): 50.8,0 121.92,0 172.72,50.8 172.72,121.92 121.92,172.72 50.8,172.72 0,121.92 0,50.8

### Text on the board
Top: FUENTES